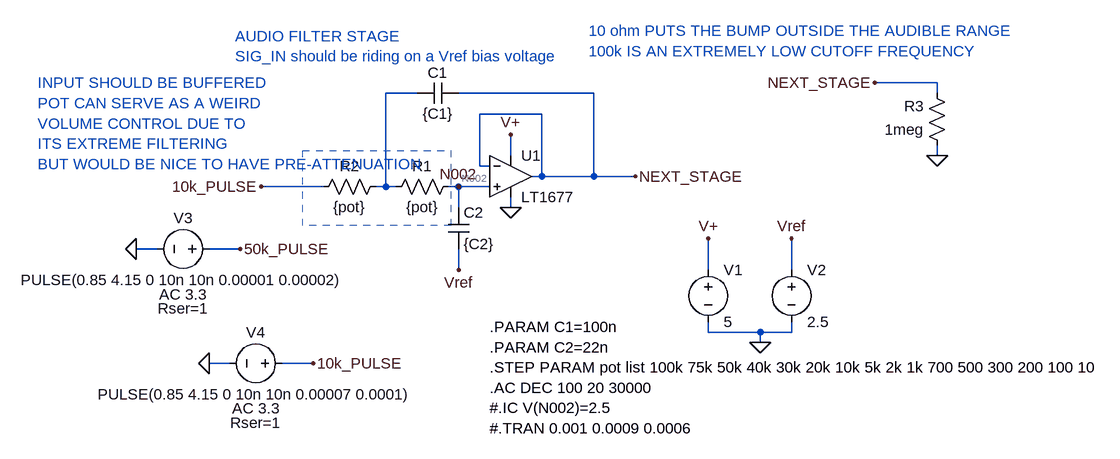
[diagram p0: schematic Draft1.asc]
Draft1.asc, the LTspice schematic file:
Version 4
SHEET 1 1248 680
WIRE 960 128 864 128
WIRE 160 144 112 144
WIRE 432 144 224 144
WIRE 960 144 960 128
WIRE 352 176 256 176
WIRE 304 240 304 208
WIRE 960 240 960 224
WIRE 256 256 256 176
WIRE 272 256 256 256
WIRE 352 272 352 176
WIRE 352 272 336 272
WIRE 432 272 432 144
WIRE 432 272 352 272
WIRE 496 272 432 272
WIRE 16 288 -80 288
WIRE 112 288 112 144
WIRE 112 288 96 288
WIRE 128 288 112 288
WIRE 224 288 208 288
WIRE 272 288 224 288
WIRE 224 320 224 288
WIRE 304 320 304 304
WIRE -240 384 -272 384
WIRE -112 384 -160 384
WIRE 224 416 224 384
WIRE 608 416 608 368
WIRE 736 416 736 368
WIRE 608 512 608 496
WIRE 688 512 608 512
WIRE 736 512 736 496
WIRE 736 512 688 512
WIRE 688 528 688 512
WIRE -128 560 -160 560
WIRE 0 560 -48 560
FLAG 688 528 0
FLAG 608 368 V+
FLAG 736 368 Vref
FLAG 304 320 0
FLAG 304 208 V+
FLAG -80 288 10k_PULSE
FLAG 496 272 NEXT_STAGE
FLAG 224 416 Vref
FLAG -272 384 0
FLAG -112 384 50k_PULSE
FLAG 864 128 NEXT_STAGE
FLAG 960 240 0
FLAG 224 288 N002
FLAG -160 560 0
FLAG 0 560 10k_PULSE
SYMBOL Opamps/LT1677 304 208 R0
SYMATTR InstName U1
SYMBOL voltage 608 400 R0
SYMATTR InstName V1
SYMATTR Value 5
SYMBOL voltage 736 400 R0
SYMATTR InstName V2
SYMATTR Value 2.5
SYMBOL cap 224 128 R90
WINDOW 0 0 32 VBottom 2
WINDOW 3 32 32 VTop 2
SYMATTR InstName C1
SYMATTR Value {C1}
SYMBOL res 224 272 R90
WINDOW 0 0 56 VBottom 2
WINDOW 3 32 56 VTop 2
SYMATTR InstName R1
SYMATTR Value {pot}
SYMBOL res 112 272 R90
WINDOW 0 0 56 VBottom 2
WINDOW 3 32 56 VTop 2
SYMATTR InstName R2
SYMATTR Value {pot}
SYMBOL cap 208 320 R0
SYMATTR InstName C2
SYMATTR Value {C2}
SYMBOL voltage -144 384 R90
WINDOW 0 -32 56 VBottom 2
WINDOW 3 32 56 VTop 2
WINDOW 123 54 56 VTop 2
WINDOW 39 76 56 VTop 2
SYMATTR InstName V3
SYMATTR Value PULSE(0.85 4.15 0 10n 10n 0.00001 0.00002)
SYMATTR Value2 AC 3.3
SYMATTR SpiceLine Rser=1
SYMBOL res 976 240 R180
WINDOW 0 36 76 Left 2
WINDOW 3 36 40 Left 2
SYMATTR InstName R3
SYMATTR Value 1meg
SYMBOL voltage -32 560 R90
WINDOW 0 -32 56 VBottom 2
WINDOW 3 32 56 VTop 2
WINDOW 123 54 56 VTop 2
WINDOW 39 76 56 VTop 2
SYMATTR InstName V4
SYMATTR Value PULSE(0.85 4.15 0 10n 10n 0.00007 0.0001)
SYMATTR Value2 AC 3.3
SYMATTR SpiceLine Rser=1
TEXT -120 56 Left 2 ;AUDIO FILTER STAGE\nSIG_IN should be riding on a Vref bias voltage
TEXT 272 504 Left 2 !.PARAM C1=100n\n.PARAM C2=22n\n.STEP PARAM pot list 100k 75k 50k 40k 30k 20k 10k 5k 2k 1k 700 500 300 200 100 10\n.AC DEC 100 20 30000\n#.IC V(N002)=2.5\n#.TRAN 0.001 0.0009 0.0006
TEXT -424 128 Left 2 ;INPUT SHOULD BE BUFFERED\nPOT CAN SERVE AS A WEIRD\nVOLUME CONTROL DUE TO\nITS EXTREME FILTERING\nBUT WOULD BE NICE TO HAVE PRE-ATTENUATION
TEXT 424 48 Left 2 ;10 ohm PUTS THE BUMP OUTSIDE THE AUDIBLE RANGE\n100k IS AN EXTREMELY LOW CUTOFF FREQUENCY
RECTANGLE Normal -16 232 212 348 3

The netlist it stands for:
* Draft1.asc
XU1 N002 NEXT_STAGE V+ 0 NEXT_STAGE LT1677  ; pins In+ In- V+ V- OUT
V1 V+ 0 5
V2 Vref 0 2.5
C1 NEXT_STAGE N001 {C1}
R1 N002 N001 {pot}
R2 N001 10k_PULSE {pot}
C2 N002 Vref {C2}
V3 50k_PULSE 0 PULSE(0.85 4.15 0 10n 10n 0.00001 0.00002) AC 3.3 Rser=1
R3 0 NEXT_STAGE 1meg
V4 10k_PULSE 0 PULSE(0.85 4.15 0 10n 10n 0.00007 0.0001) AC 3.3 Rser=1
* AUDIO FILTER STAGE
* SIG_IN should be riding on a Vref bias voltage
.PARAM C1=100n
.PARAM C2=22n
.STEP PARAM pot list 100k 75k 50k 40k 30k 20k 10k 5k 2k 1k 700 500 300 200 100 10
.AC DEC 100 20 30000
#.IC V(N002)=2.5
#.TRAN 0.001 0.0009 0.0006
* INPUT SHOULD BE BUFFERED
* POT CAN SERVE AS A WEIRD
* VOLUME CONTROL DUE TO
* ITS EXTREME FILTERING
* BUT WOULD BE NICE TO HAVE PRE-ATTENUATION
* 10 ohm PUTS THE BUMP OUTSIDE THE AUDIBLE RANGE
* 100k IS AN EXTREMELY LOW CUTOFF FREQUENCY
.lib LTC.lib
.backanno
.end